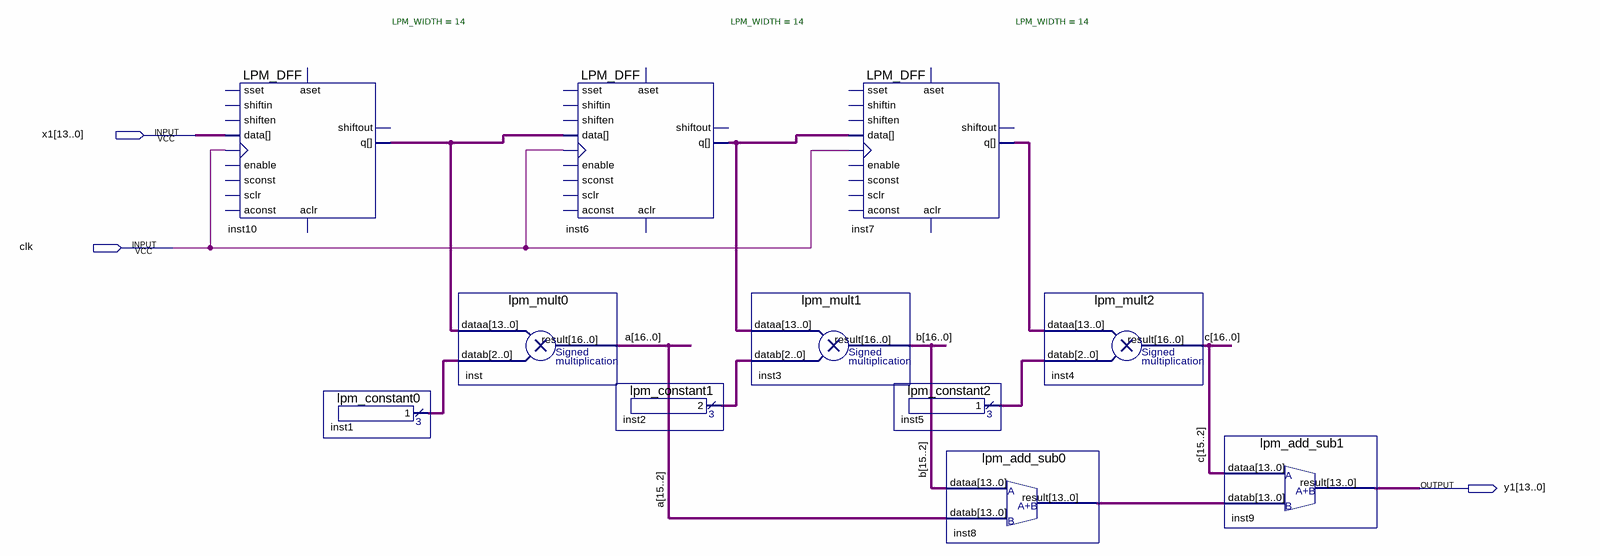
[diagram p0: schematic sheet]
// Quartus schematic Tiefpass.bdf as structural Verilog: 11 symbols, 3 pins
module Tiefpass (
  input  [13:0] x1,
  input  clk,
  output [13:0] y1
);

  wire [2:0] inst1_result, inst2_result, inst5_result;
  wire [13:0] inst6_q, inst7_q, inst8_result, inst10_q;
  wire [16:0] a, b, c;

  LPM_DFF #(.LPM_WIDTH(14)) inst10 (
    .clock(clk), .data(x1), .q(inst10_q));  // open: shiftin, shiften, enable, aconst, sclr, sconst, sset, aset, aclr, shiftout
  lpm_constant0 inst1 (.result(inst1_result));
  lpm_mult0 inst (.dataa(inst10_q), .datab(inst1_result), .result(a));
  LPM_DFF #(.LPM_WIDTH(14)) inst6 (
    .clock(clk), .data(inst10_q), .q(inst6_q));  // open: shiftin, shiften, enable, aconst, sclr, sconst, sset, aset, aclr, shiftout
  lpm_constant1 inst2 (.result(inst2_result));
  lpm_mult1 inst3 (.dataa(inst6_q), .datab(inst2_result), .result(b));
  LPM_DFF #(.LPM_WIDTH(14)) inst7 (
    .clock(clk), .data(inst6_q), .q(inst7_q));  // open: shiftin, shiften, enable, aconst, sclr, sconst, sset, aset, aclr, shiftout
  lpm_constant2 inst5 (.result(inst5_result));
  lpm_add_sub0 inst8 (.dataa(b[15:2]), .datab(a[15:2]), .result(inst8_result));
  lpm_mult2 inst4 (.dataa(inst7_q), .datab(inst5_result), .result(c));
  lpm_add_sub1 inst9 (.dataa(c[15:2]), .datab(inst8_result), .result(y1));
endmodule
